# EAGLE design Tom Titor Logic Board Rebuilt (EAGLE 9.6.2)
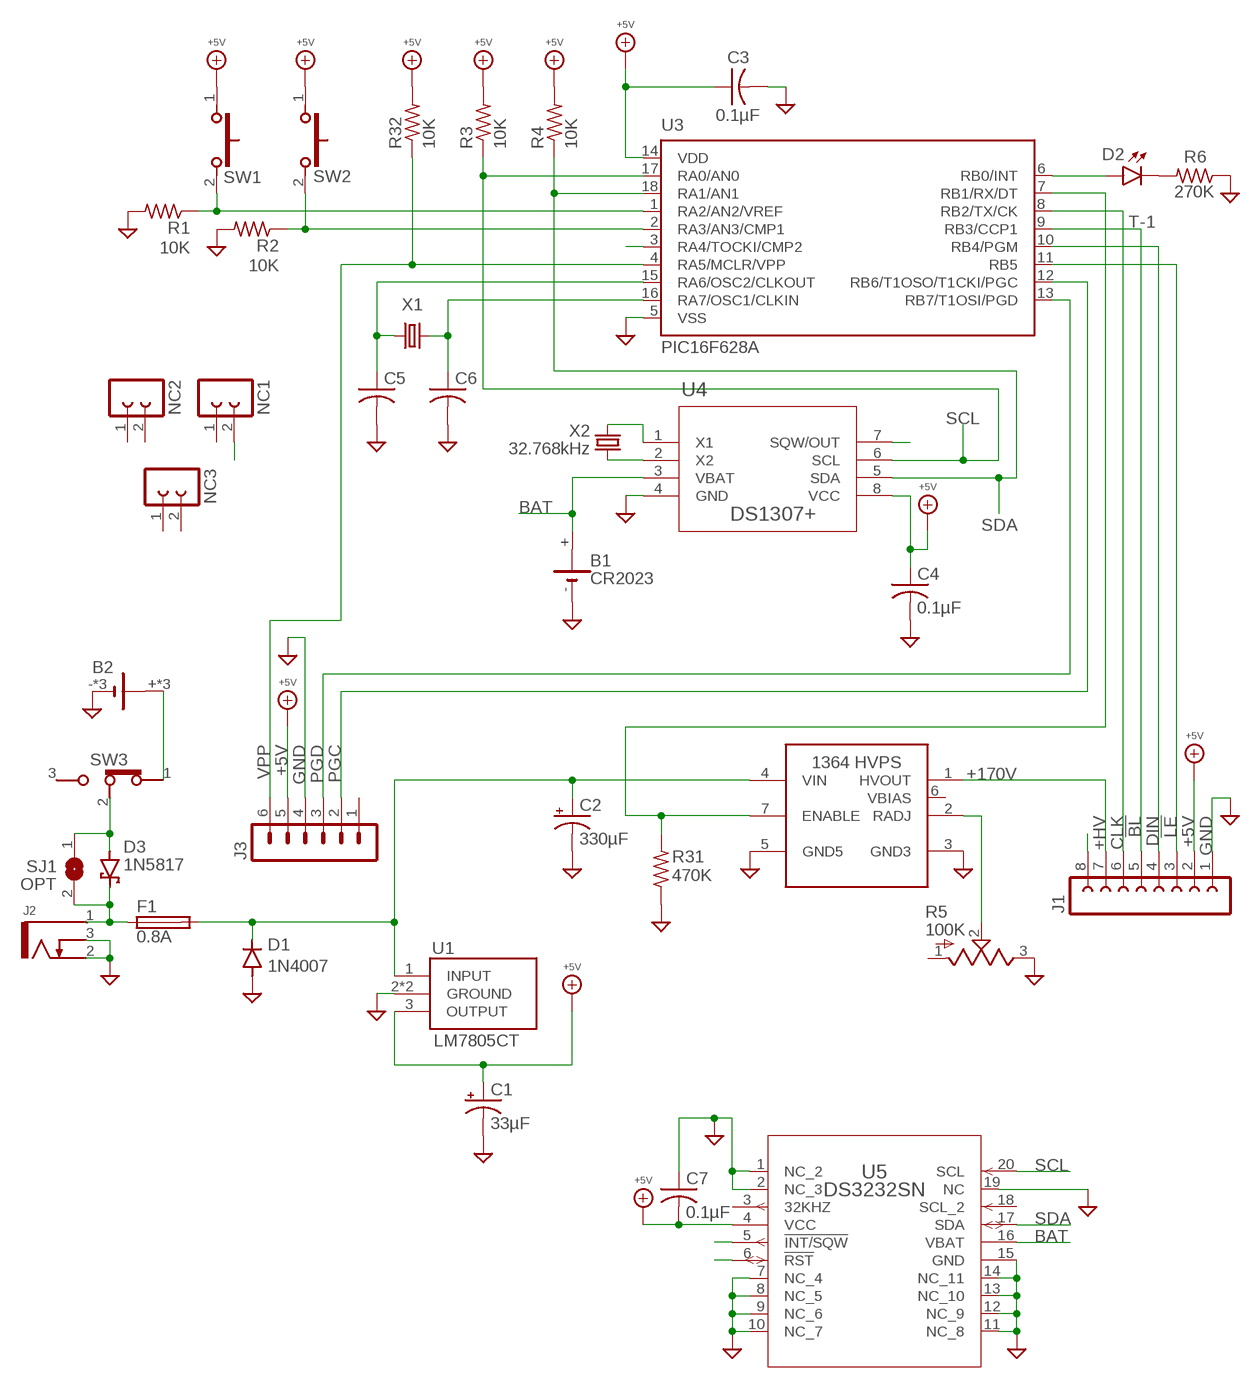
[diagram p0: schematic, sheet 1]

## Parts
B1  CR2023  BATTERY  [103]
B2  BATTERYWIRE_ATTACH  [BATTERY_WIRE]
C1  33µF  CPOL-USE2-5  [E2-5]
C2  330µF  CPOL-USE3.5-8  [E3,5-8]
C3  0.1µF  C-US  [C025-040X050]
C4  0.1µF  C-US  [C025-040X050]
C5  0.1µF  C-US  [C025-040X050]
C6  0.1µF  C-US  [C025-040X050]
C7  0.1µF  C-USC0805  [C0805]
D1  1N4007  RECTIFIER  [DO41-7]
D2  T-1  LED  [LED3MM]
D3  1N5817  SCHOTTKY  [DO41-7]
F1  0.8A  FUSE  [5X20MM]
J1  FE08  [FE08]
J2  KLDX-0202-B  [KDLX-0202-X]
J3  MA06  [MA06]
NC1  FE02  [FE02]
NC2  FE02  [FE02]
NC3  FE02  [FE02]
R1  10K  R-US0207/10  [0207/10]
R2  10K  R-US0207/10  [0207/10]
R3  10K  R-US0207/10  [0207/10]
R4  10K  R-US0207/10  [0207/10]
R5  100K  R-US_TRIM  [PV37W]
R6  270K  R-US0207/10  [0207/10]
R31  470K  R-US0207/10  [0207/10]
R32  10K  R-US0207/10  [0207/10]
SJ1  OPT  SJ  [SJ]
SW1  FSMRA4JH  SWITCH_PUSH_SPST_(ON)  [FSMRA4JH]
SW2  FSMRA4JH  SWITCH_PUSH_SPST_(ON)  [FSMRA4JH]
SW3  102-1261-EV  SWITCH_SLIDE_SPDT_ON  [SLIDE_SPDT_MINI]
U1  LM7805CT  MC7805CTG  [TO-220-3_RA]
U2  1364-HVPS-H  [1364-HVPS-H]
U3  PIC16F628A  PIC16F628P  [DIP-18]
U4  DS1307+  [DIP-8]
U5  DS3232SN  [SOIC-20]
X1  CRYSTAL  [HC18U-V_ALT]
X2  32.768kHz  CRYSTALTC38H  [TC38H]

## Nets
!BL!: J1.5 U3.9(RB3/CCP1)
!LE!: J1.3 U3.11(RB5)
+5V: C1.+ C3.1 C4.1 C7.2 J1.2 J3.5 R3.2 R4.2 R32.2 SW1.1 SW2.1 U1.3(OUTPUT) U3.14(VDD) U4.8(VCC) U5.4(VCC)
+9V: D3.C F1.1A F1.1B J2.1 SJ1.2
+9V_1: C2.+ D1.C F1.2A F1.2B U1.1(INPUT) U2.4(VIN)
+9V_2: D3.A SJ1.1 SW3.2(COM)
+9V_4: B2.+ B2.N$1(+) B2.N$2(+) SW3.1(POS_1)
+HV: J1.7 U2.1(HVOUT)
BAT: B1.+ U4.3(VBAT) U5.16(VBAT)
CLK: J1.6 U3.8(RB2/TX/CK)
DEBUG: D2.A D2.K(C) R6.2 U3.6(RB0/INT)
DIN: J1.4 U3.10(RB4/PGM)
ENABLE: R31.2 U2.7(ENABLE) U3.7(RB1/RX/DT)
GND: B1.- B2.- B2.N$3(-) B2.N$24(-) C1.- C2.- C3.2 C4.2 C5.2 C6.2 C7.1 D1.A J1.1 J2.2 J2.3 J3.4 R1.2 R2.2 R5.3 R6.1 R31.1 U1.2(GROUND) U1.2_1(GROUND) U2.3(GND3) U2.5(GND5) U3.5(VSS) U4.4(GND) U5.1(NC_2) U5.2(NC_3) U5.7(NC_4) U5.8(NC_5) U5.9(NC_6) U5.10(NC_7) U5.11(NC_8) U5.12(NC_9) U5.13(NC_10) U5.14(NC_11) U5.15(GND) U5.19(NC)
MYSTERY_1: J1.8
MYSTERY_2: U5.5(!INT/SQW)
MYSTERY_3: U5.6(!RST)
MYSTERY_4: U3.3(RA4/TOCKI/CMP2)
MYSTERY_5: U4.7(SQW/OUT)
N$1: U4.1(X1) X2.2
N$2: U4.2(X2) X2.1
N$5: NC1.2
PGC: J3.2 U3.12(RB6/T1OSO/T1CKI/PGC)
PGD: J3.3 U3.13(RB7/T1OSI/PGD)
RADJ: R5.2 U2.2(RADJ)
SCL: R3.1 U3.17(RA0/AN0) U4.6(SCL) U5.20(SCL)
SDA: R4.1 U3.18(RA1/AN1) U4.5(SDA) U5.17(SDA)
SUPP_CRYSTAL_1: C5.1 U3.15(RA6/OSC2/CLKOUT) X1.1
SUPP_CRYSTAL_2: C6.1 U3.16(RA7/OSC1/CLKIN) X1.2
SW1: R1.1 SW1.2 U3.1(RA2/AN2/VREF)
SW2: R2.1 SW2.2 U3.2(RA3/AN3/CMP1)
VPP: J3.6 R32.1 U3.4(RA5/MCLR/VPP)
Unconnected: J3.1 NC1.1 NC2.1 NC2.2 NC3.1 NC3.2 R5.1 SW3.3(POS_2) U2.6(VBIAS) U5.3(32KHZ) U5.18(SCL_2)

## Notes on the sheet
- +170V

## Library data of the parts
B1 B2 = My Imported Components:BATTERY: LI BATTERY Varta
C1 C2 = My Imported Components:CPOL-US
C3-C6 = My Imported Components:C-US
C7 = rcl:C-US: CAPACITOR, American symbol; SPICEPREFIX: C
D1 = My Imported Components:RECTIFIER
D2 = My Imported Components:LED
D3 = My Imported Components:SCHOTTKY
F1 = My Imported Components:FUSE
J1 = My Imported Components:FE08: FEMALE HEADER; OC_FARNELL: unknown; OC_NEWARK: unknown
J2 = My Imported Components:KLDX-0202-B: https://www.mouser.com/datasheet/2/222/KLDX_0202-334781.pdf
J3 = My Imported Components:MA06: PIN HEADER; OC_FARNELL: unknown; OC_NEWARK: unknown
NC1-NC3 = My Imported Components:FE02: FEMALE HEADER
R1-R4 R6 R31 R32 = My Imported Components:R-US: RESISTOR, American symbol; SPICEPREFIX: R
R5 = My Imported Components:R-US_TRIM: Res Cermet Trimmer 1M Ohm 10% 1/4W 12(Elec)Turn 1.8mm (6.4 X 4 X 7.7mm) Pin Thru-Hole Bulk Check prices <https://pricing.snapeda.com/parts/PV37W104C01B00/Bourns/view-part?ref=eda>; AVAILABILITY: Good; DESCRIPTION: 100 kOhms 0.25W, 1/4W PC Pins Through Hole Trimmer Potentiometer Cermet 12 Turn Top Adjustment; MF: Bourns; MP: PV37W104C01B00; PACKAGE: 3224X Bourns; PRICE: None; PURCHASE-URL: https://pricing.snapeda.com/search/part/PV37W104C01B00/?ref=eda
SJ1 = jumper:SJ: SMD solder JUMPER
SW1 SW2 = My Imported Components:SWITCH_PUSH_SPST_(ON)
SW3 = My Imported Components:SWITCH_SLIDE_SPDT_ON
U1 = My Imported Components:MC7805CTG: Voltage regulator,MC7805CT 5V 1A ON Semiconductor MC7805CTG, Single Linear Voltage Regulator, 1A 5 V, +/-4%, 3-Pin TO-220 Source: Datasheet <http://www.onsemi.com/pub/Collateral/MC7800-D.PDF>; ARROW_PART_NUMBER: MC7805CTG; ARROW_PRICE-STOCK: https://www.arrow.com/en/products/mc7805ctg/on-semiconductor; DESCRIPTION: Voltage regulator,MC7805CT 5V 1A ON Semiconductor MC7805CTG, Single Linear Voltage Regulator, 1A 5 V, +/-4%, 3-Pin TO-220; HEIGHT: 4.82mm; MANUFACTURER_NAME: ON Semiconductor; MANUFACTURER_PART_NUMBER: MC7805CTG; MOUSER_PART_NUMBER: 863-MC7805CTG; MOUSER_PRICE-STOCK: https://www.mouser.co.uk/ProductDetail/ON-Semiconductor/MC7805CTG/?qs=%252B9%2Fcbd0IE0SRQQJXyw%252B9hQ%3D%3D
U2 = My Imported Components:1364-HVPS-H: https://www.shop-tes.com/content/Datasheets/8002K.pdf
U3 = My Imported Components:PIC16F62*: FLASH-Based 8-Bit CMOS Microcontroller Source: http://ww1.microchip.com/downloads/en/DeviceDoc/40300C.pdf; MF: MICROCHIP; MPN: PIC16F628-04I/P; OC_FARNELL: 9760407; OC_NEWARK: 19C7272
U4 = My Imported Components:DS1307+; BUILT_BY: EMA_UL_Team; MANUFACTURER_PART_NUMBER: DS1307+; SOURCELIBRARY: Maxim_2011-05-13; VENDOR: Maxim Integrated Products
U5 = My Imported Components:DS3232SN; BUILT_BY: EMA_UL_Team; MANUFACTURER_PART_NUMBER: ds3232sn#; SOURCELIBRARY: Maxim_2009-12-17_1; VENDOR: Maxim Integrated Products
X1 = My Imported Components:CRYSTAL
X2 = crystal:CRYSTAL: CRYSTAL; OC_FARNELL: unknown; OC_NEWARK: unknown

## Board
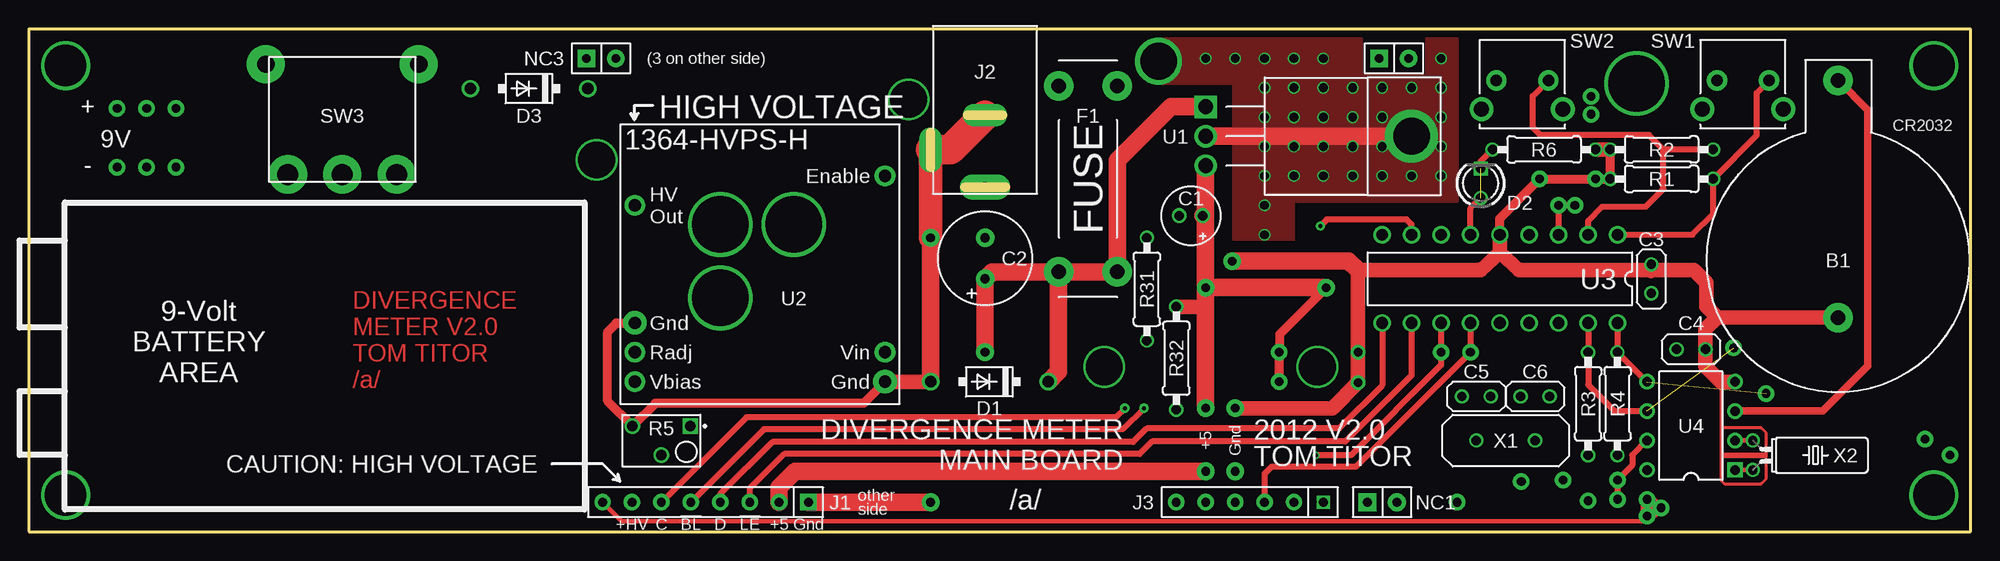
[diagram p1: board, top side]
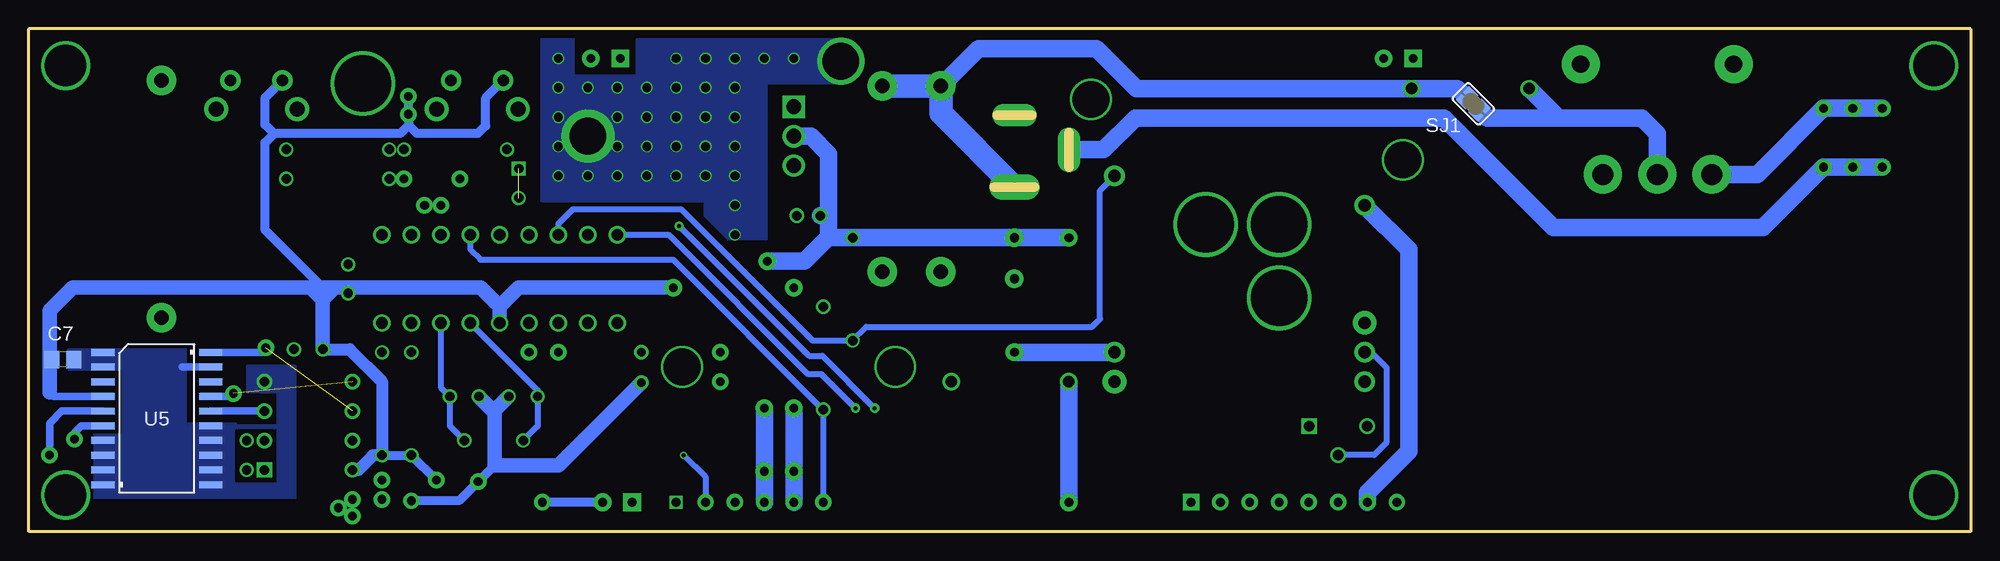
[diagram p2: board, bottom side, seen from below]

Size 167.64 x 43.43 mm. Coordinates in mm from the lower left corner, seen from the top.
Outline: 0,0 167.64,0 167.64,43.43 0,43.43 0,0
Copper layers (1*16): Top 0.035559375mm / dielectric 1.6mm / Bottom 0.035559375mm
Design rules "oshpark-2layer *": minimum track width 6mil, minimum drill 10mil, track to track 6mil, track to pad 6mil, pad to pad 6mil, via to via 6mil, smd to smd 6mil, copper to edge 15mil, drill to drill 6mil, minimum pad ring 5mil, minimum via ring 5mil, stop-mask expansion 2.5mil, vias tented up to drill 0mil, thermal gap 10mil

### Footprints (pad centres in the part's own frame; a part is rotated, then mirrored left to right if it is on the bottom)
103 = drill 1.27 pad 2.54: + 0,0; - 0,-20.498
BATTERY_WIRE = drill 0.75 pad 1.422: + 5.08,0; - 5.08,-5.08; N$1 0,0; N$2 2.54,0; N$3 0,-5.08; N$24 2.54,-5.08
E2-5 = drill 0.813 pad 1.27: + -1.016,0; - 1.016,0
E3,5-8 = drill 0.813 pad 1.6: + -1.778,0; - 1.778,0
C025-040X050 = drill 0.813: 1 -1.25,0; 2 1.25,0
C0805 = smd 1.3 x 1.5: 1 -0.95,0; 2 0.95,0
DO41-7 = drill 1: A 5.08,0; C -5.08,0
LED3MM = drill 0.813: A -1.27,0 | drill 0.813 square: K 1.27,0
5X20MM = drill 1.245 pad 2.54: 1A -8.026,2.54; 1B -8.026,-2.54; 2A 8.026,2.54; 2B 8.026,-2.54
FE08 = drill 0.75 pad 1.422 square: 1 -8.89,0 | drill 0.75 pad 1.422: 2 -6.35,0; 3 -3.81,0; 4 -1.27,0; 5 1.27,0; 6 3.81,0; 7 6.35,0; 8 8.89,0
KDLX-0202-X = drill 0.8 pad 2.184 long: 1 13.9,0 | drill 0.8 pad 1.93 long: 2 7.7,0; 3 10.7,-4.7
MA06 = drill 0.75 square: 1 -6.35,0 | drill 0.75 pad 1.422: 2 -3.81,0; 3 -1.27,0; 4 1.27,0; 5 3.81,0; 6 6.35,0
FE02 = drill 0.75 pad 1.524 square: 1 -1.27,0 | drill 0.75 pad 1.524: 2 1.27,0
0207/10 = drill 0.813: 1 -4.445,0; 2 4.445,0
PV37W = drill 0.9 square: 1 -2.5,-1.25 | drill 0.9: 2 0,1.25; 3 2.5,-1.25
SJ = smd 1.168 x 1.6: 1 -0.762,0; 2 0.762,0
FSMRA4JH = drill 0.991 pad 1.753: 1 4.496,0; 2 0,0 | drill 1.295 pad 2.057: 3 -1.245,2.489; 4 5.766,2.489
SLIDE_SPDT_MINI = drill 1.8 pad 3.302: 1 -4.699,0; 2 0,0; 3 4.699,0 | drill 1.5 pad 3.302: P$4 -6.604,9.525; P$5 6.604,9.525
TO-220-3_RA = drill 1.29 pad 1.935 square: 1 0,0 | drill 1.29 pad 1.935: 2 2.54,0; 3 5.08,0 | drill 3.175 pad 4.572: 2_1 2.54,17.78
1364-HVPS-H = drill 1.067 pad 1.778: 1 1.27,17.145; 2 1.27,4.445; 4 22.86,4.445; 6 1.27,1.905; 7 22.86,19.685 | drill 1.067 pad 2.032: 3 1.27,6.985; 5 22.86,1.905
DIP-18 = drill 1: 1 -10.16,-3.81; 2 -7.62,-3.81; 3 -5.08,-3.81; 4 -2.54,-3.81; 5 0,-3.81; 6 2.54,-3.81; 7 5.08,-3.81; 8 7.62,-3.81; 9 10.16,-3.81; 10 10.16,3.81; 11 7.62,3.81; 12 5.08,3.81; 13 2.54,3.81; 14 0,3.81; 15 -2.54,3.81; 16 -5.08,3.81; 17 -7.62,3.81; 18 -10.16,3.81
DIP-8 = drill 0.813 pad 1.321 square: 1 0,0 | drill 0.813 pad 1.321: 2 0,-2.54; 3 0,-5.08; 4 0,-7.62; 5 7.62,-7.62; 6 7.62,-5.08; 7 7.62,-2.54; 8 7.62,0
SOIC-20 = smd 2 x 0.6: 1 -4.65,5.715; 2 -4.65,4.445; 3 -4.65,3.175; 4 -4.65,1.905; 5 -4.65,0.635; 6 -4.65,-0.635; 7 -4.65,-1.905; 8 -4.65,-3.175; 9 -4.65,-4.445; 10 -4.65,-5.715; 11 4.65,-5.715; 12 4.65,-4.445; 13 4.65,-3.175; 14 4.65,-1.905; 15 4.65,-0.635; 16 4.65,0.635; 17 4.65,1.905; 18 4.65,3.175; 19 4.65,4.445; 20 4.65,5.715
HC18U-V_ALT = drill 0.813: 1 -2.54,0; 2 2.54,0
TC38H = drill 0.813: 1 -1.27,0; 2 1.27,0

### Placement (x,y rotation side)
B1  156.21,38.99 0 top
B2  7.62,36.58 0 top
C1  100.33,27.3 180 top
C2  82.55,23.62 90 top
C3  140.08,21.84 90 top
C4  143.51,15.75 0 top
C5  124.97,11.68 0 top
C6  130.05,11.68 180 top
C7  164.73,14.87 180 bottom
D1  82.93,12.95 180 top
D2  125.35,30.1 90 top
D3  43.18,38.28 180 top
F1  91.44,30.48 270 top
J1  58.42,2.54 180 top
J2  82.55,43.69 270 top
J3  105.41,2.54 180 top
NC1  116.84,2.54 0 top
NC2  117.86,40.89 0 top
NC3  49.4,40.89 0 top
R1  140.97,30.48 180 top
R2  140.97,33.02 180 top
R3  134.62,11.05 270 top
R4  137.16,11.05 270 top
R5  54.61,7.87 180 top
R6  130.81,33.02 180 top
R31  96.52,20.95 270 top
R32  99.06,14.99 90 top
SJ1  42.93,36.96 135 bottom
SW1  150.24,38.99 180 top
SW2  131.19,38.99 180 top
SW3  27.05,30.86 0 top
U1  101.6,36.7 270 top
U2  51.05,11.05 0 top
U3  127,21.84 180 top
U4  147.32,5.33 180 top
U5  156.6,9.78 0 bottom
X1  127.51,7.87 0 top
X2  148.84,6.6 270 top

### Tracks (layer width: path | path; a pad name or v marks a point on that pad's centre or on a via)
!BL!  (via drill 0.35 pad 0.79)
  Top 0.508: J1.5 63.45,8.84 94.44,8.84 v96.27,10.67
  Bottom 0.508: U3.9 112.42,25.65 100.36,13.59 99.19,13.59 v96.27,10.67
!LE!
  Top 0.508: U3.11 119.38,13.51 113.67,7.8 96.98,7.8 95.89,6.71 65.2,6.71 62.23,3.73 J1.3
+5V  (via drill 0.75 pad 1.42, 0.75 pad 1.52)
  Top 0.762: v112.01,21.08 107.97,17.04 v107.95,15.49 v107.95,12.95
  Top 1.27: R32.2 101.52,19.43 101.6,19.36
  Top 1.524: U1.3 101.6,27.3 | 101.6,27.3 v101.6,21.08 | v101.6,21.08 101.6,19.36 v101.6,10.67 | v101.6,5.21 66.17,5.21 64.77,3.81 J1.2 | v101.6,21.08 v112.01,21.08 | C1.+ 101.6,27.3
  Bottom 0.635: U5.4 165.48,11.68 165.84,12.04
  Bottom 0.762: R4.2 R3.2 v132.46,4.45 | 142.26,21.08 147.24,26.06 147.24,33.62 146.47,34.39 | 134.87,35.13 134.14,34.39 128.88,34.39 128.19,35.08 128.19,37.49 SW2.1 | 134.87,35.13 135.61,34.39 146.47,34.39 | 134.87,35.13 v134.87,36.07 v134.87,37.59 | 146.47,34.39 147.24,35.16 147.24,37.49 SW1.1
  Bottom 1.016: C4.1 139.93,15.75 137.16,12.98 R4.2 137.92,6.6 139.19,5.33 U4.8
  Bottom 1.27: 141.22,21.08 140.11,21.08 | 140.11,21.08 128.63,21.08 127,19.46 | v112.01,21.08 125.37,21.08 127,19.46 | C4.1 142.26,20.05 | 142.26,20.05 141.22,21.08 | C3.1 140.06,21.03 140.11,21.08 | 142.26,20.05 143.3,21.08 | 141.22,21.08 142.26,21.08 143.3,21.08 | U3.14 127,19.46 | 165.84,12.04 165.84,14.96 | 165.84,14.96 165.84,19.13 163.88,21.08 143.3,21.08 | C7.2 165.69,14.96 165.84,14.96
  Bottom 1.524: v101.6,10.67 v101.6,5.21 J3.5
+9V
  Bottom 1.016: 43.71,37.69 43.49,37.47 SJ1.2
  Bottom 1.524: F1.1B 85.67,41.73 75.49,41.73 72.03,38.28 D3.C 44.3,38.28 43.71,37.69
  Bottom 2.032: J2.1 88.9,36.14 F1.1B F1.1A
+9V_1  (via drill 0.75 pad 1.52)
  Top 1.524: F1.2B F1.2A 93.98,32.08 98.6,36.7 U1.1 | F1.2B 83.16,22.45 C2.+ v82.55,15.49 | F1.2B 88.9,13.84 D1.C
  Bottom 1.524: U2.4 v82.55,15.49
+9V_2
  Bottom 1.016: SJ1.1 42.41,36.39 42.11,36.09
  Bottom 1.524: SW3.2 27.05,34.39 28.37,35.71 35.53,35.71 | D3.A 35.53,35.71 | 42.11,36.09 41.73,35.71 35.53,35.71
+9V_4
  Bottom 1.524: SW3.1 18.41,30.86 B2.+ B2.N$2 B2.N$1
+HV
  Bottom 1.524: U2.1 48.51,24.38 48.51,6.93 52.07,3.38 J1.7
BAT
  Top 0.635: U4.3 154.86,10.41 158.78,14.33 158.78,36.42 B1.+
  Bottom 0.635: U4.3 U5.16
CLK  (via drill 0.35 pad 0.79)
  Top 0.508: U3.8 119.38,26.54 118.95,26.98 112.06,26.98 v111.51,26.42 | v94.61,10.67 93.83,9.88 61.95,9.88 J1.6
  Bottom 0.508: v111.51,26.42 100.28,15.19 99.14,15.19 v94.61,10.67
DEBUG  (1 unrouted)
  Top 0.508: U3.6 124.46,27.94 D2.A | D2.K 125.35,32 R6.2
DIN
  Top 0.508: U3.10 116.84,12.65 113.11,8.91 96.5,8.91 95.33,7.75 64.19,7.75 59.69,3.25 J1.4
ENABLE
  Bottom 0.508: U2.7 75.16,29.49 75.16,18.39 75.84,17.7 95.33,17.7 R31.2 99.97,16.51 111.33,27.86 120.67,27.86 121.92,26.62 U3.7
GND  (via drill 0.75, 0.75 pad 1.27, 0.75 pad 1.42, 0.75 pad 1.52, 3.17 pad 4.06)
  Top 0.254: 146.08,12.95 146.08,8.97 | 149.99,6.53 149.99,4.57 149.56,4.14 146.39,4.14 146.08,4.45 146.08,6.53 | 149.99,6.53 149.99,6.73 | 149.99,6.73 149.99,8.53 149.56,8.97 146.08,8.97 | 146.08,8.97 146.08,6.73 | 146.08,6.73 146.08,6.53 | 146.08,6.73 149.99,6.73 | 146.08,6.53 149.99,6.53
  Top 0.762: U2.5 72.06,11.1 54.09,11.1 R5.3 49.96,11.27 49.96,17.27 50.72,18.03 U2.3 | U3.5 127,27.05 v130.43,30.48 v135.25,30.48 R1.2 R2.2
  Top 1.27: D1.A U2.5 | 140.03,22.61 128.63,22.61 127,24.13 | 140.03,22.61 143.74,22.61 144.83,21.51 144.83,19.46 145.77,18.52 | C3.2 140.06,22.53 140.03,22.61 | U3.5 127,24.13 | 127,24.13 125.37,22.61 114.76,22.61 v114.76,15.49 v114.76,12.88 112.55,10.67 v104.14,10.67 | B1.- 145.77,18.52 | 145.77,18.52 144.76,17.51 C4.2 144.76,14.28 146.08,12.95 U4.4 | R6.1 R2.2
  Top 1.524: v77.85,25.4 D1.A | J1.1 v77.85,2.54 | v103.89,23.37 113.94,23.37 114.76,22.61 | U1.2 U1.2_1
  Top 2.032: J2.3 v77.85,25.4
  Top 2.54: J2.2 79.55,32.99 J2.3
  Bottom 0.635: U5.19 154.41,14.22
  Bottom 0.762: 127.43,5.74 v128.85,4.32 130.5,2.67 v134.62,2.67
  Bottom 1.27: v114.76,12.88 121.89,5.74 127.43,5.74 127.43,10.32 | C6.2 127.43,10.32 | C5.2 127.43,10.47 127.43,10.32
  Bottom 1.524: v77.85,25.4 C2.- R31.1 98.6,25.4 | D1.A v77.85,2.54 | 98.6,25.4 98.6,27.3 | 98.6,27.3 98.6,32.64 100.13,34.16 U1.2 | 98.6,25.4 98.65,25.4 100.69,23.37 v103.89,23.37 | v104.14,10.67 v104.14,5.21 J3.4 | J2.3 74.86,32.99 72.11,35.74 45.49,35.74 36.02,26.26 17.93,26.26 B2.- B2.N$24 B2.N$3 | C1.- 98.6,27.3
  other vias: 101.6,40.89 104.14,40.89 106.68,40.89 109.22,40.89 111.76,40.89 106.68,38.35 109.22,38.35 111.76,38.35 114.3,38.35 97.54,40.64 116.84,38.35 119.38,38.35 121.92,38.35 121.92,35.81 121.92,33.27 121.92,30.73 119.38,30.73 116.84,30.73 114.3,30.73 111.76,30.73 109.22,30.73 106.68,30.73 106.68,28.19 106.68,25.65 106.68,33.27 109.22,33.27 111.76,33.27 114.3,33.27 116.84,33.27 116.84,35.81 114.3,35.81 111.76,35.81 109.22,35.81 106.68,35.81 121.92,40.89
  pour Top (no thermals): 97.61,42.6 97.61,38.68 103.96,38.68 103.96,25.22 109.27,25.22 109.27,28.52 123.37,28.52 123.37,42.6 120.6,42.6 120.6,39.42 115.11,39.42 115.11,42.6
  pour Bottom (no thermals): 97.61,42.6 97.61,38.68 103.96,38.68 103.96,25.22 107.26,25.22 109.27,27.23 109.27,28.52 123.37,28.52 123.37,42.6 120.6,42.6 120.6,39.42 115.11,39.42 115.11,42.6
  pour Bottom (no thermals): 146.18,12.01 148.79,12.01 148.79,14.35 144.65,14.35 144.65,2.87 161.98,2.87 161.98,8.41 159.54,8.41 159.54,13.97 164.19,13.97 164.19,15.8 154.13,15.8 154.13,9.37 149.78,9.37 149.78,9.22 146.18,9.22
  cutout Bottom (no thermals): 146.33,8.76 149.78,8.76 149.78,4.34 146.33,4.34
MYSTERY_1  (via drill 0.75 pad 1.42)
  Top 0.381: J1.8 51.16,0.91 139.27,0.91 v139.7,1.35
  Top 1.016: v139.7,1.35 v139.7,2.79 v140.92,2.06 v139.7,1.35
MYSTERY_2  (via drill 0.75 pad 1.42)
  Bottom 0.635: v165.86,6.6 165.86,9.35 164.79,10.41 U5.5
MYSTERY_3  (via drill 0.75 pad 1.42)
  Bottom 0.635: v163.7,8 163.7,8.56 163.12,9.14 U5.6
MYSTERY_4  (via drill 0.75 pad 1.42)
  Top 0.508: U3.3 v132.08,28.19 v133.48,28.19
MYSTERY_5  (via drill 0.75 pad 1.42)
  Top 0.508: U4.7 138.43,6.6 138.43,5.71 v137.16,4.45 v137.16,2.79
N$1
  Top 0.381: X2.2 U4.1
N$2
  Top 0.381: X2.1 U4.2
N$3  (via drill 3.17 pad 3.61)
  other vias: 49.02,32.13
N$5  (via drill 0.75 pad 1.42)
  Bottom 0.762: NC1.2 v123.32,2.54
N$21  (via drill 3.58 pad 4.27)
  other vias: 3.17,40.26
N$22  (via drill 3.58 pad 4.27)
  other vias: 3.17,3.17
N$23  (via drill 3.58 pad 4.27)
  other vias: 164.47,40.26
N$24  (via drill 3.58 pad 4.27)
  other vias: 164.47,3.17
N$25  (via drill 3.17 pad 3.61)
  other vias: 75.95,37.34
N$26  (via drill 3.17 pad 3.61)
  other vias: 92.84,14.22
N$27  (via drill 3.17 pad 3.61)
  other vias: 111.25,14.22
N$28  (via drill 4.88 pad 5.59)
  other vias: 59.69,26.54
N$29  (via drill 4.88 pad 5.59)
  other vias: 66.04,26.54
N$30  (via drill 4.88 pad 5.59)
  other vias: 59.69,20.19
N$31  (via drill 4.88 pad 5.59)
  other vias: 138.81,38.73
PGC  (via drill 0.35, 0.75 pad 1.42)
  Top 0.508: U3.12 v121.92,15.49 121.92,14.4 114.12,6.6 v111.12,6.6
  Bottom 0.508: v111.12,6.6 109.22,4.75 J3.2
PGD  (via drill 0.75 pad 1.42)
  Top 0.508: U3.13 v124.46,15.49 114.58,5.61 107.29,5.61 106.68,5 J3.3
RADJ
  Bottom 0.508: R5.2 51.49,6.62 50.39,7.72 50.39,14.15 51.74,15.49 U2.2
SCL  (via drill 0.75 pad 1.42)  (1 unrouted)
  Top 0.508: U3.17 R3.1 134.62,12.7 136.91,10.41 U4.6
  Bottom 0.635: U5.20 147.57,15.49 v147.19,15.88
SDA  (via drill 0.75 pad 1.42)  (1 unrouted)
  Top 0.508: U3.18 R4.1 U4.5
  Bottom 0.635: v149.99,11.94 150.24,11.68 U5.17
SUPP_CRYSTAL_1
  Bottom 0.508: U3.15 123.72,12.21 C5.1 123.72,9.12 X1.1
SUPP_CRYSTAL_2
  Bottom 0.508: U3.16 132.08,12.47 C6.1 131.3,9.12 X1.2
SW1
  Top 0.508: U3.1 143.64,25.65 145.41,27.43 R1.1 149.17,34.24 149.17,37.92 SW1.2
SW2
  Top 0.508: U3.2 134.62,26.87 135.81,28.07 139.6,28.07 141.12,29.59 141.12,33.02 | 141.12,33.02 139.88,34.27 130.5,34.27 129.84,34.92 129.84,37.64 SW2.2 | R2.1 141.12,33.02
VPP
  Bottom 0.508: J3.6 R32.1 112.01,23.5 128.65,23.5 129.54,24.38 U3.4

### Text on the board
Top: DIVERGENCE / METER V2.0 / TOM TITOR / /a/
tPlace: (3 on other side) | + | HIGH VOLTAGE | CR2032 | 9V | - | 9-Volt / BATTERY / AREA | DIVERGENCE METER / MAIN BOARD | 2012 V2.0 / TOM TITOR | +5 | Gnd | CAUTION: HIGH VOLTAGE | /a/ | other / side | +HV | C | !BL! | D | !LE! | +5 | Gnd
tStop: DIVERGENCE / METER V2.0 / TOM TITOR / /a/